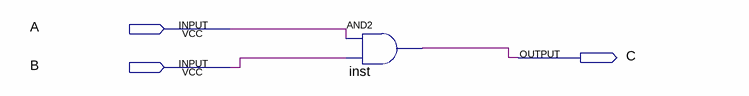
[diagram p0: schematic sheet]
// Quartus schematic Testbench.bdf as structural Verilog: 1 symbols, 3 pins
module Testbench (
  input  A,
  input  B,
  output C
);

  and inst (C, A, B);
endmodule
